# Altium schematic sheet ST_LINK_V2-1.SCHDOC: STLINK/V2-1
size A4; DocumentNumber: MB1136; Revision: C.3; SheetNumber: 4; SheetTotal: 5; Project: NUCLEO-XXXXRX
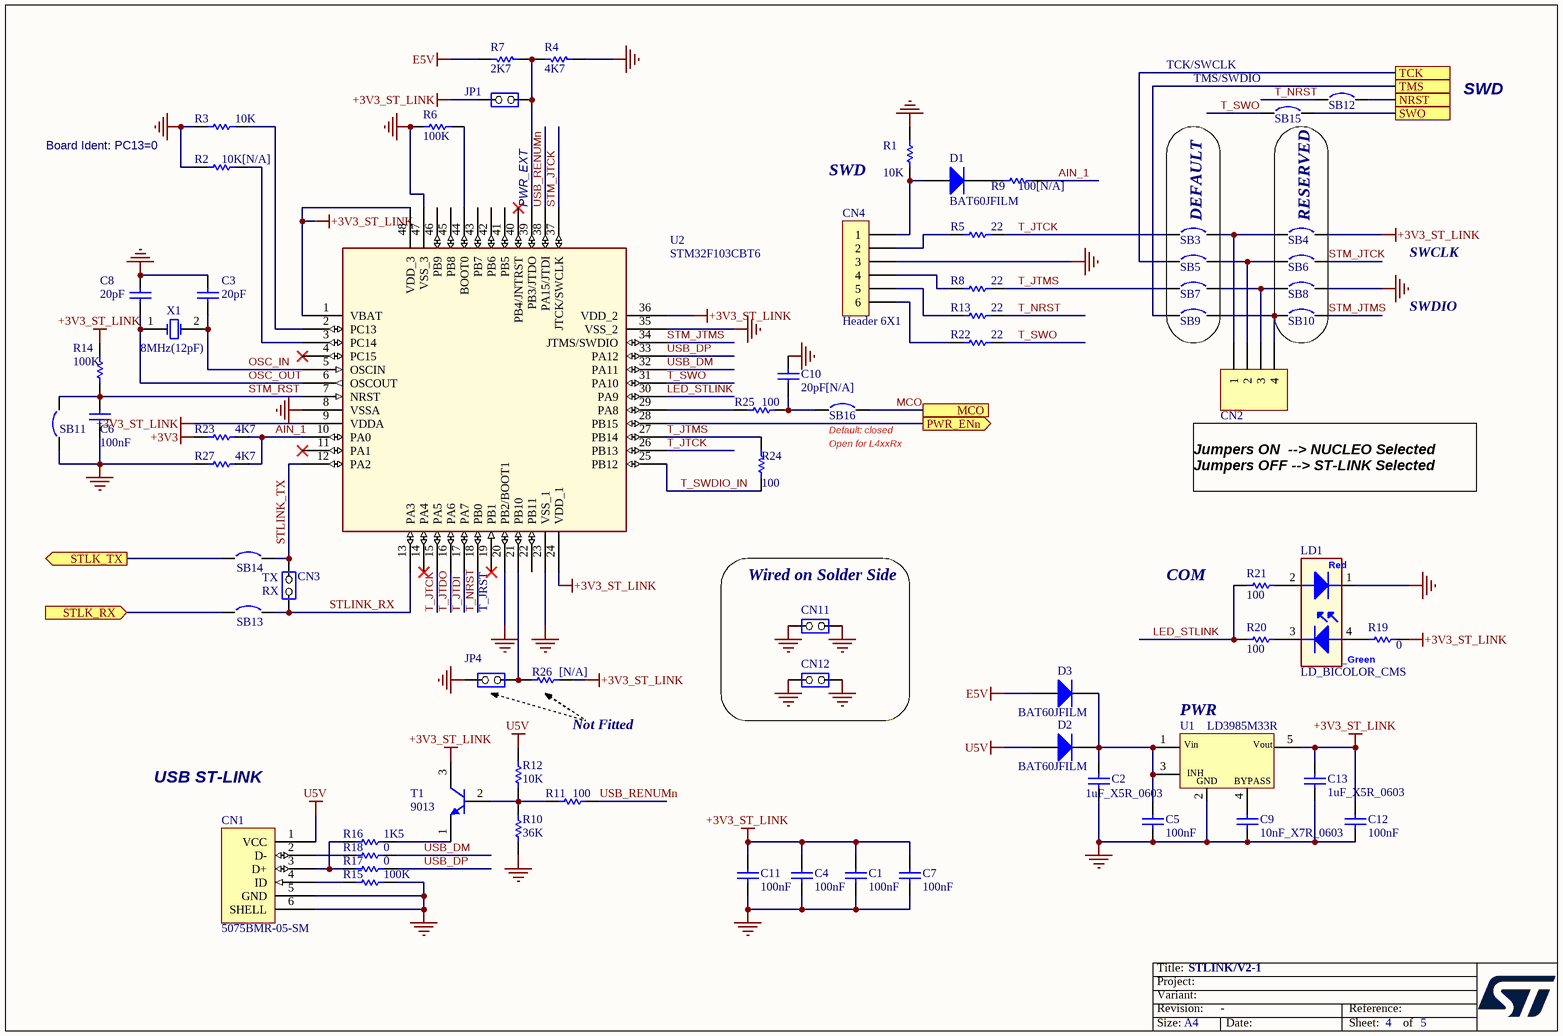
[diagram p0: ST_LINK_V2-1.SCHDOC]

## Parts
C1  100nF  [0603C]
C2  1uF_X5R_0603  [0603C]
C3  20pF  [0603C]
C4  100nF  [0603C]
C5  100nF  [0603C]
C6  100nF  [0603C]
C7  100nF  [0603C]
C8  20pF  [0603C]
C9  10nF_X7R_0603  [0603C]
C10  20pF[N/A]  [0603C]
C11  100nF  [0603C]
C12  100nF  [0603C]
C13  1uF_X5R_0603  [0603C]
CN1  5075BMR-05-SM  [USB-MINI-B-SMD]
CN2  Header 4  [1*4]  (value not drawn)
CN3  (no value)  [SIP2/2.54]
CN4  Header 6X1  [1*6P]
CN11  (no value)  [SIP2/2.54]
CN12  (no value)  [SIP2/2.54]
D1  BAT60JFILM  [SOD323/A]
D2  BAT60JFILM  [SOD323/A]
D3  BAT60JFILM  [SOD323/A]
JP1  (no value)  [SIP2/2.54]
JP4  (no value)  [SIP2/2.54]
LD1  LD_BICOLOR_CMS  [HSMF-A201]
R1  10K  [0603R]
R2  10K[N/A]  [0603R]
R3  10K  [0603R]
R4  4K7  [0603R]
R5  22  [0603R]
R6  100K  [0603R]
R7  2K7  [0603R]
R8  22  [0603R]
R9  100[N/A]  [0603R]
R10  36K  [0603R]
R11  100  [0603R]
R12  10K  [0603R]
R13  22  [0603R]
R14  100K  [0603R]
R15  100K  [0603R]
R16  1K5  [0603R]
R17  0  [0603R]
R18  0  [0603R]
R19  0  [0603R]
R20  100  [0603R]
R21  100  [0603R]
R22  22  [0603R]
R23  4K7  [0603R]
R24  100  [0603R]
R25  100  [0603R]
R26  [N/A]  [0603R]
R27  4K7  [0603R]
SB3  Circuit Breaker  [JP2_SMD]  (value not drawn)
SB4  Circuit Breaker  [JP2_SMD]  (value not drawn)
SB5  Circuit Breaker  [JP2_SMD]  (value not drawn)
SB6  Circuit Breaker  [JP2_SMD]  (value not drawn)
SB7  Circuit Breaker  [JP2_SMD]  (value not drawn)
SB8  Circuit Breaker  [JP2_SMD]  (value not drawn)
SB9  Circuit Breaker  [JP2_SMD]  (value not drawn)
SB10  Circuit Breaker  [JP2_SMD]  (value not drawn)
SB11  Circuit Breaker  [JP2_SMD]  (value not drawn)
SB12  Circuit Breaker  [JP2_SMD]  (value not drawn)
SB13  Circuit Breaker  [JP2_SMD]  (value not drawn)
SB14  Circuit Breaker  [JP2_SMD]  (value not drawn)
SB15  Circuit Breaker  [JP2_SMD]  (value not drawn)
SB16  Circuit Breaker  [JP2_SMD]  (value not drawn)
T1  9013  [SOT-23]
U1  LD3985M33R  [SOT-23-5L]
U2  STM32F103CBT6  [QFP48 7X7]
X1  8MHz(12pF)  [XTAL1]

## Blocks framed on the sheet
DEFAULT: SB3 SB5 SB7 SB9
RESERVED: SB4 SB6 SB8 SB10
Wired on Solder Side: CN11 CN12

## Ports
MCO, NRST, PWR_ENn (out), STLK_RX (in), STLK_TX (out), SWO, TCK, TMS

## Nets
+3V3: R23.1
+3V3_ST_LINK: C1.2 C4.2 C7.2 C11.2 C12.2 C13.1 JP1.1(COMMON) R14.2 R19.2 R26.1 SB4.2 T1.3(C) U1.5(Vout) U2.1(VBAT) U2.9(VDDA) U2.24(VDD_1) U2.36(VDD_2) U2.48(VDD_3)
E5V: D3.1(A) R7.1
GND: C1.1 C2.1 C3.2 C4.1 C5.1 C6.1 C7.1 C8.2 C9.1 C10.2 C11.1 C12.1 C13.2 CN1.5(GND) CN1.6(SHELL) CN4.3 CN11.1(COMMON) CN11.2(NO) CN12.1(COMMON) CN12.2(NO) JP4.1(COMMON) LD1.1 R1.2 R2.1 R3.1 R4.2 R6.1 R10.1 R15.2 R27.1 SB8.2 SB11.1 U1.2(GND) U2.8(VSSA) U2.20(PB2/BOOT1) U2.23(VSS_1) U2.35(VSS_2) U2.47(VSS_3)
U5V: CN1.1(VCC) D2.1(A) R12.2
AIN_1: R9.2 R23.2 R27.2 U2.10(PA0)
LED_STLINK: R20.1 R21.1 U2.30(PA9)
MCO: SB16.2 ; port MCO
NRST: SB12.2 ; port NRST
OSC_IN: C3.1 U2.5(OSCIN) X1.2(OSC2)
OSC_OUT: C8.1 U2.6(OSCOUT) X1.1(OSC1)
PWR_ENn: U2.28(PB15) ; port PWR_ENn
STLINK_RX: CN3.1(COMMON) SB13.2 U2.13(PA3)
STLINK_TX: CN3.2(NO) SB14.2 U2.12(PA2)
STLK_RX: SB13.1 ; port STLK_RX
STLK_TX: SB14.1 ; port STLK_TX
STM_JTCK: SB6.2 U2.37(JTCK/SWCLK)
STM_JTMS: SB10.2 U2.34(JTMS/SWDIO)
STM_RST: C6.2 R14.1 SB11.2 U2.7(NRST)
SWO: SB15.2 ; port SWO
T_JTCK: R5.2 SB3.1 U2.15(PA5) U2.26(PB13)
T_JTDI: U2.17(PA7)
T_JTDO: U2.16(PA6)
T_JTMS: R8.2 R24.2 SB7.1 U2.27(PB14)
T_NRST: R13.2 SB12.1 U2.18(PB0)
T_SWDIO_IN: R24.1 U2.25(PB12)
T_SWO: R22.2 SB15.1 U2.31(PA10)
TCK: SB5.1 ; port TCK
TMS: SB9.1 ; port TMS
USB_DM: R18.2 U2.32(PA11)
USB_DP: R17.2 U2.33(PA12)
USB_RENUMn: R11.2 U2.38(PA15/JTDI)
NetC2_2: C2.2 C5.2 D2.2(K) D3.2(K) U1.1(Vin) U1.3(CE)
NetC9_2: C9.2 U1.4(BYPASS)
NetC10_1: C10.1 R25.2 SB16.1
NetCN1_2: CN1.2(D-) R18.1
NetCN1_3: CN1.3(D+) R16.1 R17.1
NetCN1_4: CN1.4(ID) R15.1
NetCN2_1: CN2.1 SB3.2 SB4.1
NetCN2_2: CN2.2 SB5.2 SB6.1
NetCN2_3: CN2.3 SB7.2 SB8.1
NetCN2_4: CN2.4 SB9.2 SB10.1
NetCN4_1: CN4.1 D1.1(A) R1.1
NetCN4_2: CN4.2 R5.1
NetCN4_4: CN4.4 R8.1
NetCN4_5: CN4.5 R13.1
NetCN4_6: CN4.6 R22.1
NetD1_2: D1.2(K) R9.1
NetJP1_2: JP1.2(NO) R4.1 R7.2 U2.39(PB3/JTDO)
NetJP4_2: JP4.2(NO) R26.2 U2.21(PB10)
NetLD1_2: LD1.2 R21.2
NetLD1_3: LD1.3 R20.2
NetLD1_4: LD1.4 R19.1
NetR2_2: R2.2 U2.3(PC14)
NetR3_2: R3.2 U2.2(PC13)
NetR6_2: R6.2 U2.44(BOOT0)
NetR10_2: R10.2 R11.1 R12.1 T1.2(B)
NetR16_2: R16.2 T1.1(E)
NetR25_1: R25.1 U2.29(PA8)

Not connected (* = marked no-connect by the designer): U2 4(PC15)* 11(PA1)* 14(PA4)* 19(PB1)* 22(PB11) 40(PB4/JNTRST)* 41(PB5) 42(PB6) 43(PB7) 45(PB8) 46(PB9)

## Notes on the sheet
- TCK/SWCLK
- (near SB15) TMS/SWDIO
- SWD
- Board Ident: PC13=0
- (near U2) PWR_EXT
- SWCLK
- SWDIO
- (near SB16) Default: closed
- (near SB16) Open for L4xxRx
- Jumpers ON  --> NUCLEO Selected
  Jumpers OFF --> ST-LINK Selected
- TX
- COM
- RX
- T_JRST
- (near U1) PWR
- USB ST-LINK
- Not Fitted
- Title:
- Project:
- Size:
- Revision:
- Variant:
- A4
- -
- Date:
- Reference:
- Sheet:
- of
- (in symbol LD3985M33R) INH
- (in symbol LD_BICOLOR_CMS) Red; _Green

## Library data of the parts
C1 C4-C7 C11 C12 = Capacitor_ST: Capacitor 0402 / 0603 / 0805; Revision: July-2002: Re-released for DXP Platform.; Value: 100nF
C2 C13 = CAP SMD 0603  X5R 1µF 25V 10%: 0603  X5R 1µF; Rated voltage: 25V; Tolerance: 10%; Manufacturer: *; Manufacturer P/N: *; Order code Farnell: 1288202RL; Value: 1µF; Power: *; Technology: X5R; Temperature  Factor: *; Temperature Max: +125°C; Temperature Min: -55°C; STS Code: *
C3 C8 C10 = Capacitor_ST: Capacitor 0402 / 0603 / 0805; Value: 100nF; Revision: July-2002: Re-released for DXP Platform.
C9 = CAP SMD 0603  X7R 10000PF 50V 10%: 0603  X7R 10NF; Order code RS: 2040779; Rated voltage: 50V; Tolerance: 10%; Order code Farnell: 7569548RL; Value: 10NF; Power: *; Technology: X7R; Temperature Factor: *; Temperature Min: -55°C; Temperature Max: +125°C; STS Code: *
CN1 = USB-MINI-typeB connector: Manuf_Part_1: 5075BMR-05-SM; Order: 5075BMR-05-SM; ECCN: ????
CN2 = Header 4: Header, 4-Pin, Single row; Revision: 17-Jul-2002: Re-released for DXP Platform.; Publisher: Altium Limited
CN3 = JP2: Fitted: NO
CN4 = Header 6X1: Header, 6-Pin, Single row; LatestRevisionDate: 17-Jul-2002; LatestRevisionNote: Re-released for DXP Platform.; Publisher: Altium Limited
CN11 CN12 JP1 JP4 = JP2
D1-D3 = BAT60JFILM: Manuf_1: STM; Provided: ST; ECCN_US/EU: EAR99/NEC; Revision: July-2002: Re-released for DXP Platform.; Order: BAT60JFILM; Manuf_Part_1: BAT60JFILM; Distrib: ST
LD1 = LD_BICOLOR_CMS: Bicolor Led; Manuf_Part_1: HSMF-A201-A00J1; Manuf_1: Avago Technologies; Ref St: xxxxxx; cap_dec: ----; Distrib: RADIOSPARES
R1 R3 = Resistor_ST: Resistor 0402 / 0603 / 0805; Value: 10K
R2 R23 R27 = Resistor_ST: Resistor 0402 / 0603 / 0805; Value: 10K; Fitted: NO
R4 R7 R10 R12 R26 = Res1: Resistor; Value: 1K; Published: 8-Jun-2000; Revision: July-2002: Re-released for DXP Platform.; Publisher: Altium Limited
R5 R6 R8 R9 R11 R13-R22 R24 R25 = Resistor_ST: Resistor 0402 / 0603 / 0805; Value: 10K
SB3 SB5 SB7 SB9 SB11 SB13-SB16 = Circuit Breaker: Solder: NO; Published: 24-Mar-1999; Revision: July-2002: Re-released for DXP Platform.; Publisher: Altium Limited
SB4 SB6 SB8 SB10 SB12 = Circuit Breaker: Solder: YES; Published: 24-Mar-1999; Revision: July-2002: Re-released for DXP Platform.; Publisher: Altium Limited
T1 = NPN: NPN Bipolar Transistor; Code - JEDEC: TO-226-AA; Published: 8-Jun-2000; Revision: July-2002: Re-released for DXP Platform.; Publisher: Altium Limited
U1 = LD3985M33R: Ultra low drop-low noise BiCMOS voltage, regulators low ESR capacitors compatible; Manuf_1: STM; Provided: ST; Ref St: 9176161; ECCN_US/EU: EAR99/NEC; Manuf_Part_1: LD3985M33R; Distrib: ST; Order: LD3985M33R
U2 = STM32F103CBT6: Medium-density performance line ARM-based 32-bit MCU with 64KB Flash; Manuf_Part_1: STM32F103C8T6; Manuf_1: STM; Ref St: 9175981; Provided: ST; ECCN_US/EU: 3A991A2/NEC; Distrib: ST; Order: STM32F103C8T6
X1 = XTAL: Crystal Oscillator; Published: 8-Jun-2000; LatestRevisionDate: 17-Jul-2002; LatestRevisionNote: Re-released for DXP Platform.; PackageReference: R38; Publisher: Altium Limited